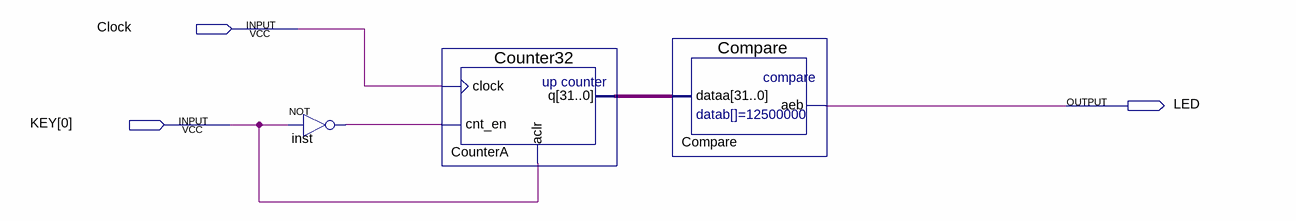
[diagram p0: schematic sheet]
// Quartus schematic debounce_p (2022_05_22 18_19_10 UTC).bdf as structural Verilog: 3 symbols, 3 pins
module \debounce_p_(2022_05_22_18_19_10_UTC)  (
  input  Clock,
  input  [0:0] KEY,
  output LED
);

  wire inst_out;
  wire [31:0] CounterA_q;

  not inst (inst_out, KEY[0]);
  Counter32 CounterA (.clock(Clock), .cnt_en(inst_out), .aclr(KEY[0]), .q(CounterA_q));
  Compare Compare (.dataa(CounterA_q), .aeb(LED));
endmodule
